# Altium schematic sheet circuit de commande.SchDoc
size A4
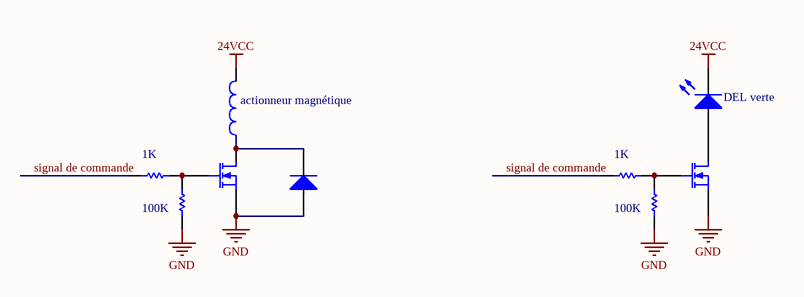
[diagram p0: circuit de commande.SchDoc]

## Parts
2  value 1K  [AXIAL-0.3]  (hidden comment: Res1)
4  value 1K  [AXIAL-0.3]  (hidden comment: Res1)
5  value 100K  [AXIAL-0.3]  (hidden comment: Res1)
7  MOSFET-N  [E3]  (value not drawn)
12  DEL verte  [LED-0]
D?  Diode  [SMC]  (value not drawn)
L?  actionneur magnétique  [0402-A]
Q?  MOSFET-N  [E3]  (value not drawn)
R?  value 100K  [AXIAL-0.3]  (hidden comment: Res1)

## Nets
24VCC: 12.2(K) L?.2
GND: 5.1 7.3(S) D?.1(A) Q?.3(S) R?.1
signal de commande: 2.1 4.1
Net2_2: 2.2 Q?.2(G) R?.2
Net4_2: 4.2 5.2 7.2(G)
Net7_1: 7.1(D) 12.1(A)
NetD?_2: D?.2(K) L?.1 Q?.1(D)

## Library data of the parts
2 4 5 R? = Res1: Resistor; Published: 8-Jun-2000; LatestRevisionDate: 17-Jul-2002; LatestRevisionNote: Re-released for DXP Platform.; PackageReference: AXIAL-0.3; Publisher: Altium Limited; PackageDescription: Axial Device, Thru-Hole; 2 Leads; 0.3 in Pin Spacing
7 Q? = MOSFET-N: N-Channel MOSFET; Published: 8-Jun-2000; LatestRevisionDate: 17-Jul-2002; LatestRevisionNote: Re-released for DXP Platform.; PackageVersion: 1995/1996; PackageReference: E3; Publisher: Altium Limited; PackageDescription: TO, Flat Index; 3 In-Line, Axial Leads; Body Dia. 4.6mm; Lead Dia. 0.5 mm (max)
12 = LED0: Typical INFRARED GaAs LED; Published: 8-Jun-2000; LatestRevisionDate: 08-Jul-2005; LatestRevisionNote: Mech Layer 1 removed.; PackageReference: LED-0; Publisher: Altium Limited; PackageDescription: LED; 2 Leads
D? = Diode: Default Diode; Published: 8-Jun-2000; LatestRevisionDate: 17-Jul-2002; LatestRevisionNote: Re-released for DXP Platform.; PackageVersion: Sep-1996; PackageReference: SMC; Publisher: Altium Limited; PackageDescription: DO-214-AB/SMC; 2 C-Bend Leads; Body 7.9 x 5.9 mm, inc. leads (LxW); Code_JEDEC: DO-214-AB
L? = Inductor: Code_IEC: 1005; Value: 10mH; Published: 8-Jun-2000; LatestRevisionDate: 29-May-2009; LatestRevisionNote: IPC-7351 Footprint Added.; PackageReference: 0402-A; Publisher: Altium Limited; PackageDescription: Chip Inductor; Code_JEITA: 0402